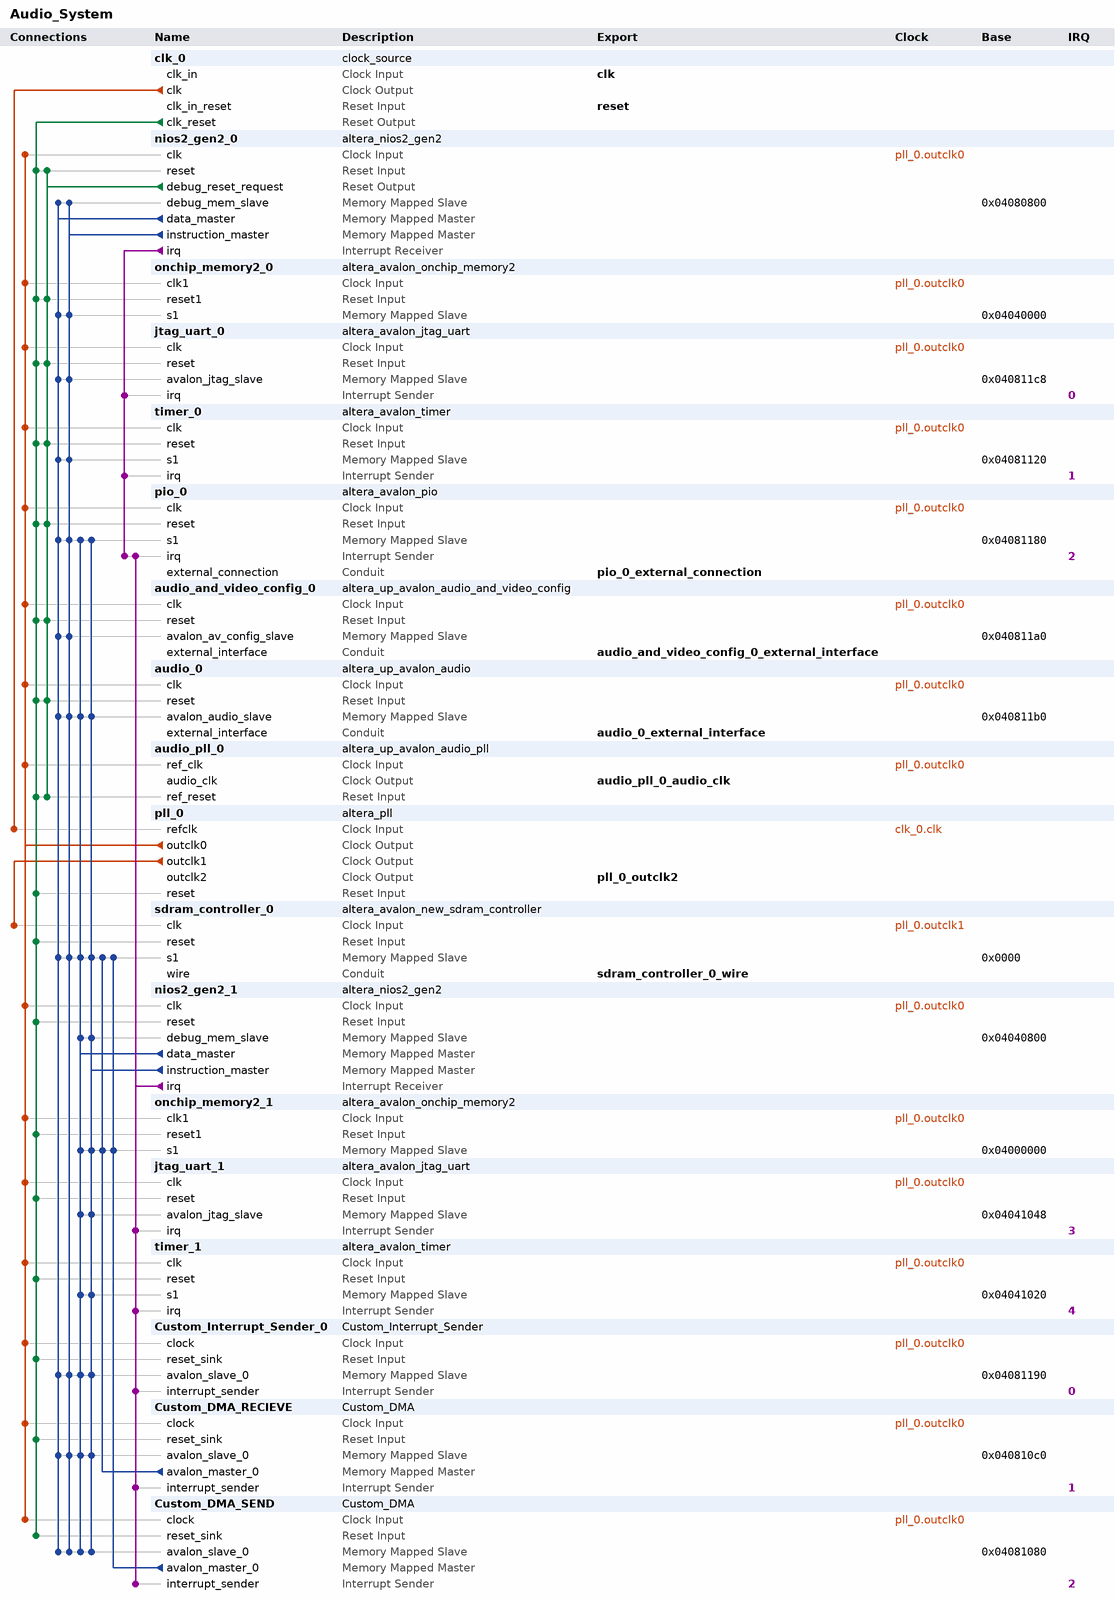
[diagram p0: system contents]
# Platform Designer (Qsys) system Audio_System, Cyclone V 5CSEMA5F31C6
# Parameters at their usual value, and those the tool derives, are not listed.
package require -exact qsys 18.1
create_system Audio_System
set_project_property DEVICE_FAMILY {Cyclone V}
set_project_property DEVICE 5CSEMA5F31C6

add_instance clk_0 clock_source 18.1
set_instance_parameter_value clk_0 clockFrequency 50000000

add_instance nios2_gen2_0 altera_nios2_gen2 18.1
set_instance_parameter_value nios2_gen2_0 dcache_size 2048
set_instance_parameter_value nios2_gen2_0 exceptionSlave onchip_memory2_0.s1
set_instance_parameter_value nios2_gen2_0 icache_size 4096
set_instance_parameter_value nios2_gen2_0 impl Fast
set_instance_parameter_value nios2_gen2_0 resetSlave onchip_memory2_0.s1

add_instance onchip_memory2_0 altera_avalon_onchip_memory2 18.1
set_instance_parameter_value onchip_memory2_0 dataWidth 32
set_instance_parameter_value onchip_memory2_0 dualPort false
set_instance_parameter_value onchip_memory2_0 initMemContent true
set_instance_parameter_value onchip_memory2_0 initializationFileName onchip_mem.hex
set_instance_parameter_value onchip_memory2_0 memorySize 153600

add_instance jtag_uart_0 altera_avalon_jtag_uart 18.1
set_instance_parameter_value jtag_uart_0 simInteractiveOptions NO_INTERACTIVE_WINDOWS

add_instance timer_0 altera_avalon_timer 18.1
set_instance_parameter_value timer_0 period 100
set_instance_parameter_value timer_0 periodUnits USEC

add_instance pio_0 altera_avalon_pio 18.1
set_instance_parameter_value pio_0 bitClearingEdgeCapReg true
set_instance_parameter_value pio_0 captureEdge true
set_instance_parameter_value pio_0 direction Input
set_instance_parameter_value pio_0 edgeType ANY
set_instance_parameter_value pio_0 generateIRQ true
set_instance_parameter_value pio_0 irqType EDGE
set_instance_parameter_value pio_0 width 8

add_instance audio_and_video_config_0 altera_up_avalon_audio_and_video_config 18.0
set_instance_parameter_value audio_and_video_config_0 audio_in {Microphone to ADC}
set_instance_parameter_value audio_and_video_config_0 bit_length 16
set_instance_parameter_value audio_and_video_config_0 board DE1-SoC
set_instance_parameter_value audio_and_video_config_0 line_in_bypass false
set_instance_parameter_value audio_and_video_config_0 sampling_rate {48 kHz}

add_instance audio_0 altera_up_avalon_audio 18.0
set_instance_parameter_value audio_0 audio_in true
set_instance_parameter_value audio_0 avalon_bus_type {Memory Mapped}
set_instance_parameter_value audio_0 dw 16

add_instance audio_pll_0 altera_up_avalon_audio_pll 18.0
set_instance_parameter_value audio_pll_0 gui_refclk 50.0

add_instance pll_0 altera_pll 18.1
set_instance_parameter_value pll_0 gui_device_speed_grade 1
set_instance_parameter_value pll_0 gui_number_of_clocks 3
set_instance_parameter_value pll_0 gui_operation_mode direct
set_instance_parameter_value pll_0 gui_output_clock_frequency0 50.0
set_instance_parameter_value pll_0 gui_output_clock_frequency1 100.0
set_instance_parameter_value pll_0 gui_output_clock_frequency2 100.0
set_instance_parameter_value pll_0 gui_phase_shift2 -3758
set_instance_parameter_value pll_0 gui_pll_mode {Integer-N PLL}
set_instance_parameter_value pll_0 gui_reference_clock_frequency 50.0
set_instance_parameter_value pll_0 gui_use_locked true

add_instance sdram_controller_0 altera_avalon_new_sdram_controller 18.1
set_instance_parameter_value sdram_controller_0 TAC 5.5
set_instance_parameter_value sdram_controller_0 TRCD 20.0
set_instance_parameter_value sdram_controller_0 TRP 20.0
set_instance_parameter_value sdram_controller_0 casLatency 3
set_instance_parameter_value sdram_controller_0 columnWidth 10
set_instance_parameter_value sdram_controller_0 dataWidth 16
set_instance_parameter_value sdram_controller_0 generateSimulationModel false
set_instance_parameter_value sdram_controller_0 model single_Micron_MT48LC4M32B2_7_chip
set_instance_parameter_value sdram_controller_0 numberOfBanks 4
set_instance_parameter_value sdram_controller_0 numberOfChipSelects 1
set_instance_parameter_value sdram_controller_0 powerUpDelay 100.0
set_instance_parameter_value sdram_controller_0 refreshPeriod 15.625
set_instance_parameter_value sdram_controller_0 rowWidth 13

add_instance nios2_gen2_1 altera_nios2_gen2 18.1
set_instance_parameter_value nios2_gen2_1 cpuID 1
set_instance_parameter_value nios2_gen2_1 dcache_size 2048
set_instance_parameter_value nios2_gen2_1 exceptionSlave onchip_memory2_1.s1
set_instance_parameter_value nios2_gen2_1 icache_size 4096
set_instance_parameter_value nios2_gen2_1 impl Fast
set_instance_parameter_value nios2_gen2_1 resetSlave onchip_memory2_1.s1

add_instance onchip_memory2_1 altera_avalon_onchip_memory2 18.1
set_instance_parameter_value onchip_memory2_1 dataWidth 32
set_instance_parameter_value onchip_memory2_1 dualPort false
set_instance_parameter_value onchip_memory2_1 initMemContent true
set_instance_parameter_value onchip_memory2_1 initializationFileName onchip_mem.hex
set_instance_parameter_value onchip_memory2_1 memorySize 204800

add_instance jtag_uart_1 altera_avalon_jtag_uart 18.1
set_instance_parameter_value jtag_uart_1 simInteractiveOptions NO_INTERACTIVE_WINDOWS

add_instance timer_1 altera_avalon_timer 18.1
set_instance_parameter_value timer_1 period 100
set_instance_parameter_value timer_1 periodUnits USEC

add_instance Custom_Interrupt_Sender_0 Custom_Interrupt_Sender 1.0

add_instance Custom_DMA_RECIEVE Custom_DMA 1.0

add_instance Custom_DMA_SEND Custom_DMA 1.0

# connections
add_connection clk_0.clk pll_0.refclk clock
add_connection pll_0.outclk0 audio_0.clk clock
add_connection pll_0.outclk0 audio_and_video_config_0.clk clock
add_connection pll_0.outclk0 audio_pll_0.ref_clk clock
add_connection pll_0.outclk0 Custom_DMA_RECIEVE.clock clock
add_connection pll_0.outclk0 Custom_DMA_SEND.clock clock
add_connection pll_0.outclk0 Custom_Interrupt_Sender_0.clock clock
add_connection pll_0.outclk0 jtag_uart_0.clk clock
add_connection pll_0.outclk0 jtag_uart_1.clk clock
add_connection pll_0.outclk0 nios2_gen2_0.clk clock
add_connection pll_0.outclk0 nios2_gen2_1.clk clock
add_connection pll_0.outclk0 onchip_memory2_0.clk1 clock
add_connection pll_0.outclk0 onchip_memory2_1.clk1 clock
add_connection pll_0.outclk0 pio_0.clk clock
add_connection pll_0.outclk0 timer_0.clk clock
add_connection pll_0.outclk0 timer_1.clk clock
add_connection pll_0.outclk1 sdram_controller_0.clk clock
add_connection clk_0.clk_reset audio_0.reset reset
add_connection clk_0.clk_reset audio_and_video_config_0.reset reset
add_connection clk_0.clk_reset audio_pll_0.ref_reset reset
add_connection clk_0.clk_reset Custom_DMA_RECIEVE.reset_sink reset
add_connection clk_0.clk_reset Custom_DMA_SEND.reset_sink reset
add_connection clk_0.clk_reset Custom_Interrupt_Sender_0.reset_sink reset
add_connection clk_0.clk_reset jtag_uart_0.reset reset
add_connection clk_0.clk_reset jtag_uart_1.reset reset
add_connection clk_0.clk_reset nios2_gen2_0.reset reset
add_connection clk_0.clk_reset nios2_gen2_1.reset reset
add_connection clk_0.clk_reset onchip_memory2_0.reset1 reset
add_connection clk_0.clk_reset onchip_memory2_1.reset1 reset
add_connection clk_0.clk_reset pio_0.reset reset
add_connection clk_0.clk_reset pll_0.reset reset
add_connection clk_0.clk_reset sdram_controller_0.reset reset
add_connection clk_0.clk_reset timer_0.reset reset
add_connection clk_0.clk_reset timer_1.reset reset
add_connection nios2_gen2_0.debug_reset_request audio_0.reset reset
add_connection nios2_gen2_0.debug_reset_request audio_and_video_config_0.reset reset
add_connection nios2_gen2_0.debug_reset_request audio_pll_0.ref_reset reset
add_connection nios2_gen2_0.debug_reset_request jtag_uart_0.reset reset
add_connection nios2_gen2_0.debug_reset_request nios2_gen2_0.reset reset
add_connection nios2_gen2_0.debug_reset_request onchip_memory2_0.reset1 reset
add_connection nios2_gen2_0.debug_reset_request pio_0.reset reset
add_connection nios2_gen2_0.debug_reset_request timer_0.reset reset
add_connection Custom_DMA_RECIEVE.avalon_master_0 onchip_memory2_1.s1 avalon
set_connection_parameter_value Custom_DMA_RECIEVE.avalon_master_0/onchip_memory2_1.s1 baseAddress 0x04000000
add_connection Custom_DMA_RECIEVE.avalon_master_0 sdram_controller_0.s1 avalon
set_connection_parameter_value Custom_DMA_RECIEVE.avalon_master_0/sdram_controller_0.s1 baseAddress 0x0000
add_connection Custom_DMA_SEND.avalon_master_0 onchip_memory2_1.s1 avalon
set_connection_parameter_value Custom_DMA_SEND.avalon_master_0/onchip_memory2_1.s1 baseAddress 0x04000000
add_connection Custom_DMA_SEND.avalon_master_0 sdram_controller_0.s1 avalon
set_connection_parameter_value Custom_DMA_SEND.avalon_master_0/sdram_controller_0.s1 baseAddress 0x0000
add_connection nios2_gen2_0.data_master audio_0.avalon_audio_slave avalon
set_connection_parameter_value nios2_gen2_0.data_master/audio_0.avalon_audio_slave baseAddress 0x040811b0
add_connection nios2_gen2_0.data_master audio_and_video_config_0.avalon_av_config_slave avalon
set_connection_parameter_value nios2_gen2_0.data_master/audio_and_video_config_0.avalon_av_config_slave baseAddress 0x040811a0
add_connection nios2_gen2_0.data_master Custom_DMA_RECIEVE.avalon_slave_0 avalon
set_connection_parameter_value nios2_gen2_0.data_master/Custom_DMA_RECIEVE.avalon_slave_0 baseAddress 0x040810c0
add_connection nios2_gen2_0.data_master Custom_DMA_SEND.avalon_slave_0 avalon
set_connection_parameter_value nios2_gen2_0.data_master/Custom_DMA_SEND.avalon_slave_0 baseAddress 0x04081080
add_connection nios2_gen2_0.data_master Custom_Interrupt_Sender_0.avalon_slave_0 avalon
set_connection_parameter_value nios2_gen2_0.data_master/Custom_Interrupt_Sender_0.avalon_slave_0 baseAddress 0x04081190
add_connection nios2_gen2_0.data_master jtag_uart_0.avalon_jtag_slave avalon
set_connection_parameter_value nios2_gen2_0.data_master/jtag_uart_0.avalon_jtag_slave baseAddress 0x040811c8
add_connection nios2_gen2_0.data_master nios2_gen2_0.debug_mem_slave avalon
set_connection_parameter_value nios2_gen2_0.data_master/nios2_gen2_0.debug_mem_slave baseAddress 0x04080800
add_connection nios2_gen2_0.data_master onchip_memory2_0.s1 avalon
set_connection_parameter_value nios2_gen2_0.data_master/onchip_memory2_0.s1 baseAddress 0x04040000
add_connection nios2_gen2_0.data_master pio_0.s1 avalon
set_connection_parameter_value nios2_gen2_0.data_master/pio_0.s1 baseAddress 0x04081180
add_connection nios2_gen2_0.data_master sdram_controller_0.s1 avalon
set_connection_parameter_value nios2_gen2_0.data_master/sdram_controller_0.s1 baseAddress 0x0000
add_connection nios2_gen2_0.data_master timer_0.s1 avalon
set_connection_parameter_value nios2_gen2_0.data_master/timer_0.s1 baseAddress 0x04081120
add_connection nios2_gen2_0.instruction_master audio_0.avalon_audio_slave avalon
set_connection_parameter_value nios2_gen2_0.instruction_master/audio_0.avalon_audio_slave baseAddress 0x040811b0
add_connection nios2_gen2_0.instruction_master audio_and_video_config_0.avalon_av_config_slave avalon
set_connection_parameter_value nios2_gen2_0.instruction_master/audio_and_video_config_0.avalon_av_config_slave baseAddress 0x040811a0
add_connection nios2_gen2_0.instruction_master Custom_DMA_RECIEVE.avalon_slave_0 avalon
set_connection_parameter_value nios2_gen2_0.instruction_master/Custom_DMA_RECIEVE.avalon_slave_0 baseAddress 0x040810c0
add_connection nios2_gen2_0.instruction_master Custom_DMA_SEND.avalon_slave_0 avalon
set_connection_parameter_value nios2_gen2_0.instruction_master/Custom_DMA_SEND.avalon_slave_0 baseAddress 0x04081080
add_connection nios2_gen2_0.instruction_master Custom_Interrupt_Sender_0.avalon_slave_0 avalon
set_connection_parameter_value nios2_gen2_0.instruction_master/Custom_Interrupt_Sender_0.avalon_slave_0 baseAddress 0x04081190
add_connection nios2_gen2_0.instruction_master jtag_uart_0.avalon_jtag_slave avalon
set_connection_parameter_value nios2_gen2_0.instruction_master/jtag_uart_0.avalon_jtag_slave baseAddress 0x040811c8
add_connection nios2_gen2_0.instruction_master nios2_gen2_0.debug_mem_slave avalon
set_connection_parameter_value nios2_gen2_0.instruction_master/nios2_gen2_0.debug_mem_slave baseAddress 0x04080800
add_connection nios2_gen2_0.instruction_master onchip_memory2_0.s1 avalon
set_connection_parameter_value nios2_gen2_0.instruction_master/onchip_memory2_0.s1 baseAddress 0x04040000
add_connection nios2_gen2_0.instruction_master pio_0.s1 avalon
set_connection_parameter_value nios2_gen2_0.instruction_master/pio_0.s1 baseAddress 0x04081180
add_connection nios2_gen2_0.instruction_master sdram_controller_0.s1 avalon
set_connection_parameter_value nios2_gen2_0.instruction_master/sdram_controller_0.s1 baseAddress 0x0000
add_connection nios2_gen2_0.instruction_master timer_0.s1 avalon
set_connection_parameter_value nios2_gen2_0.instruction_master/timer_0.s1 baseAddress 0x04081120
add_connection nios2_gen2_1.data_master audio_0.avalon_audio_slave avalon
set_connection_parameter_value nios2_gen2_1.data_master/audio_0.avalon_audio_slave baseAddress 0x040811b0
add_connection nios2_gen2_1.data_master Custom_DMA_RECIEVE.avalon_slave_0 avalon
set_connection_parameter_value nios2_gen2_1.data_master/Custom_DMA_RECIEVE.avalon_slave_0 baseAddress 0x040810c0
add_connection nios2_gen2_1.data_master Custom_DMA_SEND.avalon_slave_0 avalon
set_connection_parameter_value nios2_gen2_1.data_master/Custom_DMA_SEND.avalon_slave_0 baseAddress 0x04081080
add_connection nios2_gen2_1.data_master Custom_Interrupt_Sender_0.avalon_slave_0 avalon
set_connection_parameter_value nios2_gen2_1.data_master/Custom_Interrupt_Sender_0.avalon_slave_0 baseAddress 0x04081190
add_connection nios2_gen2_1.data_master jtag_uart_1.avalon_jtag_slave avalon
set_connection_parameter_value nios2_gen2_1.data_master/jtag_uart_1.avalon_jtag_slave baseAddress 0x04041048
add_connection nios2_gen2_1.data_master nios2_gen2_1.debug_mem_slave avalon
set_connection_parameter_value nios2_gen2_1.data_master/nios2_gen2_1.debug_mem_slave baseAddress 0x04040800
add_connection nios2_gen2_1.data_master onchip_memory2_1.s1 avalon
set_connection_parameter_value nios2_gen2_1.data_master/onchip_memory2_1.s1 baseAddress 0x04000000
add_connection nios2_gen2_1.data_master pio_0.s1 avalon
set_connection_parameter_value nios2_gen2_1.data_master/pio_0.s1 baseAddress 0x04081180
add_connection nios2_gen2_1.data_master sdram_controller_0.s1 avalon
set_connection_parameter_value nios2_gen2_1.data_master/sdram_controller_0.s1 baseAddress 0x0000
add_connection nios2_gen2_1.data_master timer_1.s1 avalon
set_connection_parameter_value nios2_gen2_1.data_master/timer_1.s1 baseAddress 0x04041020
add_connection nios2_gen2_1.instruction_master audio_0.avalon_audio_slave avalon
set_connection_parameter_value nios2_gen2_1.instruction_master/audio_0.avalon_audio_slave baseAddress 0x040811b0
add_connection nios2_gen2_1.instruction_master Custom_DMA_RECIEVE.avalon_slave_0 avalon
set_connection_parameter_value nios2_gen2_1.instruction_master/Custom_DMA_RECIEVE.avalon_slave_0 baseAddress 0x040810c0
add_connection nios2_gen2_1.instruction_master Custom_DMA_SEND.avalon_slave_0 avalon
set_connection_parameter_value nios2_gen2_1.instruction_master/Custom_DMA_SEND.avalon_slave_0 baseAddress 0x04081080
add_connection nios2_gen2_1.instruction_master Custom_Interrupt_Sender_0.avalon_slave_0 avalon
set_connection_parameter_value nios2_gen2_1.instruction_master/Custom_Interrupt_Sender_0.avalon_slave_0 baseAddress 0x04081190
add_connection nios2_gen2_1.instruction_master jtag_uart_1.avalon_jtag_slave avalon
set_connection_parameter_value nios2_gen2_1.instruction_master/jtag_uart_1.avalon_jtag_slave baseAddress 0x04041048
add_connection nios2_gen2_1.instruction_master nios2_gen2_1.debug_mem_slave avalon
set_connection_parameter_value nios2_gen2_1.instruction_master/nios2_gen2_1.debug_mem_slave baseAddress 0x04040800
add_connection nios2_gen2_1.instruction_master onchip_memory2_1.s1 avalon
set_connection_parameter_value nios2_gen2_1.instruction_master/onchip_memory2_1.s1 baseAddress 0x04000000
add_connection nios2_gen2_1.instruction_master pio_0.s1 avalon
set_connection_parameter_value nios2_gen2_1.instruction_master/pio_0.s1 baseAddress 0x04081180
add_connection nios2_gen2_1.instruction_master sdram_controller_0.s1 avalon
set_connection_parameter_value nios2_gen2_1.instruction_master/sdram_controller_0.s1 baseAddress 0x0000
add_connection nios2_gen2_1.instruction_master timer_1.s1 avalon
set_connection_parameter_value nios2_gen2_1.instruction_master/timer_1.s1 baseAddress 0x04041020
add_connection nios2_gen2_0.irq jtag_uart_0.irq interrupt
set_connection_parameter_value nios2_gen2_0.irq/jtag_uart_0.irq irqNumber 0
add_connection nios2_gen2_0.irq pio_0.irq interrupt
set_connection_parameter_value nios2_gen2_0.irq/pio_0.irq irqNumber 2
add_connection nios2_gen2_0.irq timer_0.irq interrupt
set_connection_parameter_value nios2_gen2_0.irq/timer_0.irq irqNumber 1
add_connection nios2_gen2_1.irq Custom_DMA_RECIEVE.interrupt_sender interrupt
set_connection_parameter_value nios2_gen2_1.irq/Custom_DMA_RECIEVE.interrupt_sender irqNumber 1
add_connection nios2_gen2_1.irq Custom_DMA_SEND.interrupt_sender interrupt
set_connection_parameter_value nios2_gen2_1.irq/Custom_DMA_SEND.interrupt_sender irqNumber 2
add_connection nios2_gen2_1.irq Custom_Interrupt_Sender_0.interrupt_sender interrupt
set_connection_parameter_value nios2_gen2_1.irq/Custom_Interrupt_Sender_0.interrupt_sender irqNumber 0
add_connection nios2_gen2_1.irq jtag_uart_1.irq interrupt
set_connection_parameter_value nios2_gen2_1.irq/jtag_uart_1.irq irqNumber 3
add_connection nios2_gen2_1.irq pio_0.irq interrupt
set_connection_parameter_value nios2_gen2_1.irq/pio_0.irq irqNumber 5
add_connection nios2_gen2_1.irq timer_1.irq interrupt
set_connection_parameter_value nios2_gen2_1.irq/timer_1.irq irqNumber 4

# exported interfaces
add_interface audio_0_external_interface conduit end
set_interface_property audio_0_external_interface EXPORT_OF audio_0.external_interface
add_interface audio_and_video_config_0_external_interface conduit end
set_interface_property audio_and_video_config_0_external_interface EXPORT_OF audio_and_video_config_0.external_interface
add_interface audio_pll_0_audio_clk clock source
set_interface_property audio_pll_0_audio_clk EXPORT_OF audio_pll_0.audio_clk
add_interface clk clock sink
set_interface_property clk EXPORT_OF clk_0.clk_in
add_interface pio_0_external_connection conduit end
set_interface_property pio_0_external_connection EXPORT_OF pio_0.external_connection
add_interface pll_0_outclk2 clock source
set_interface_property pll_0_outclk2 EXPORT_OF pll_0.outclk2
add_interface reset reset sink
set_interface_property reset EXPORT_OF clk_0.clk_in_reset
add_interface sdram_controller_0_wire conduit end
set_interface_property sdram_controller_0_wire EXPORT_OF sdram_controller_0.wire

set_interconnect_requirement {$system} qsys_mm.clockCrossingAdapter HANDSHAKE
set_interconnect_requirement {$system} qsys_mm.enableEccProtection FALSE
set_interconnect_requirement {$system} qsys_mm.insertDefaultSlave FALSE
set_interconnect_requirement {$system} qsys_mm.maxAdditionalLatency 1

save_system Audio_System.qsys
